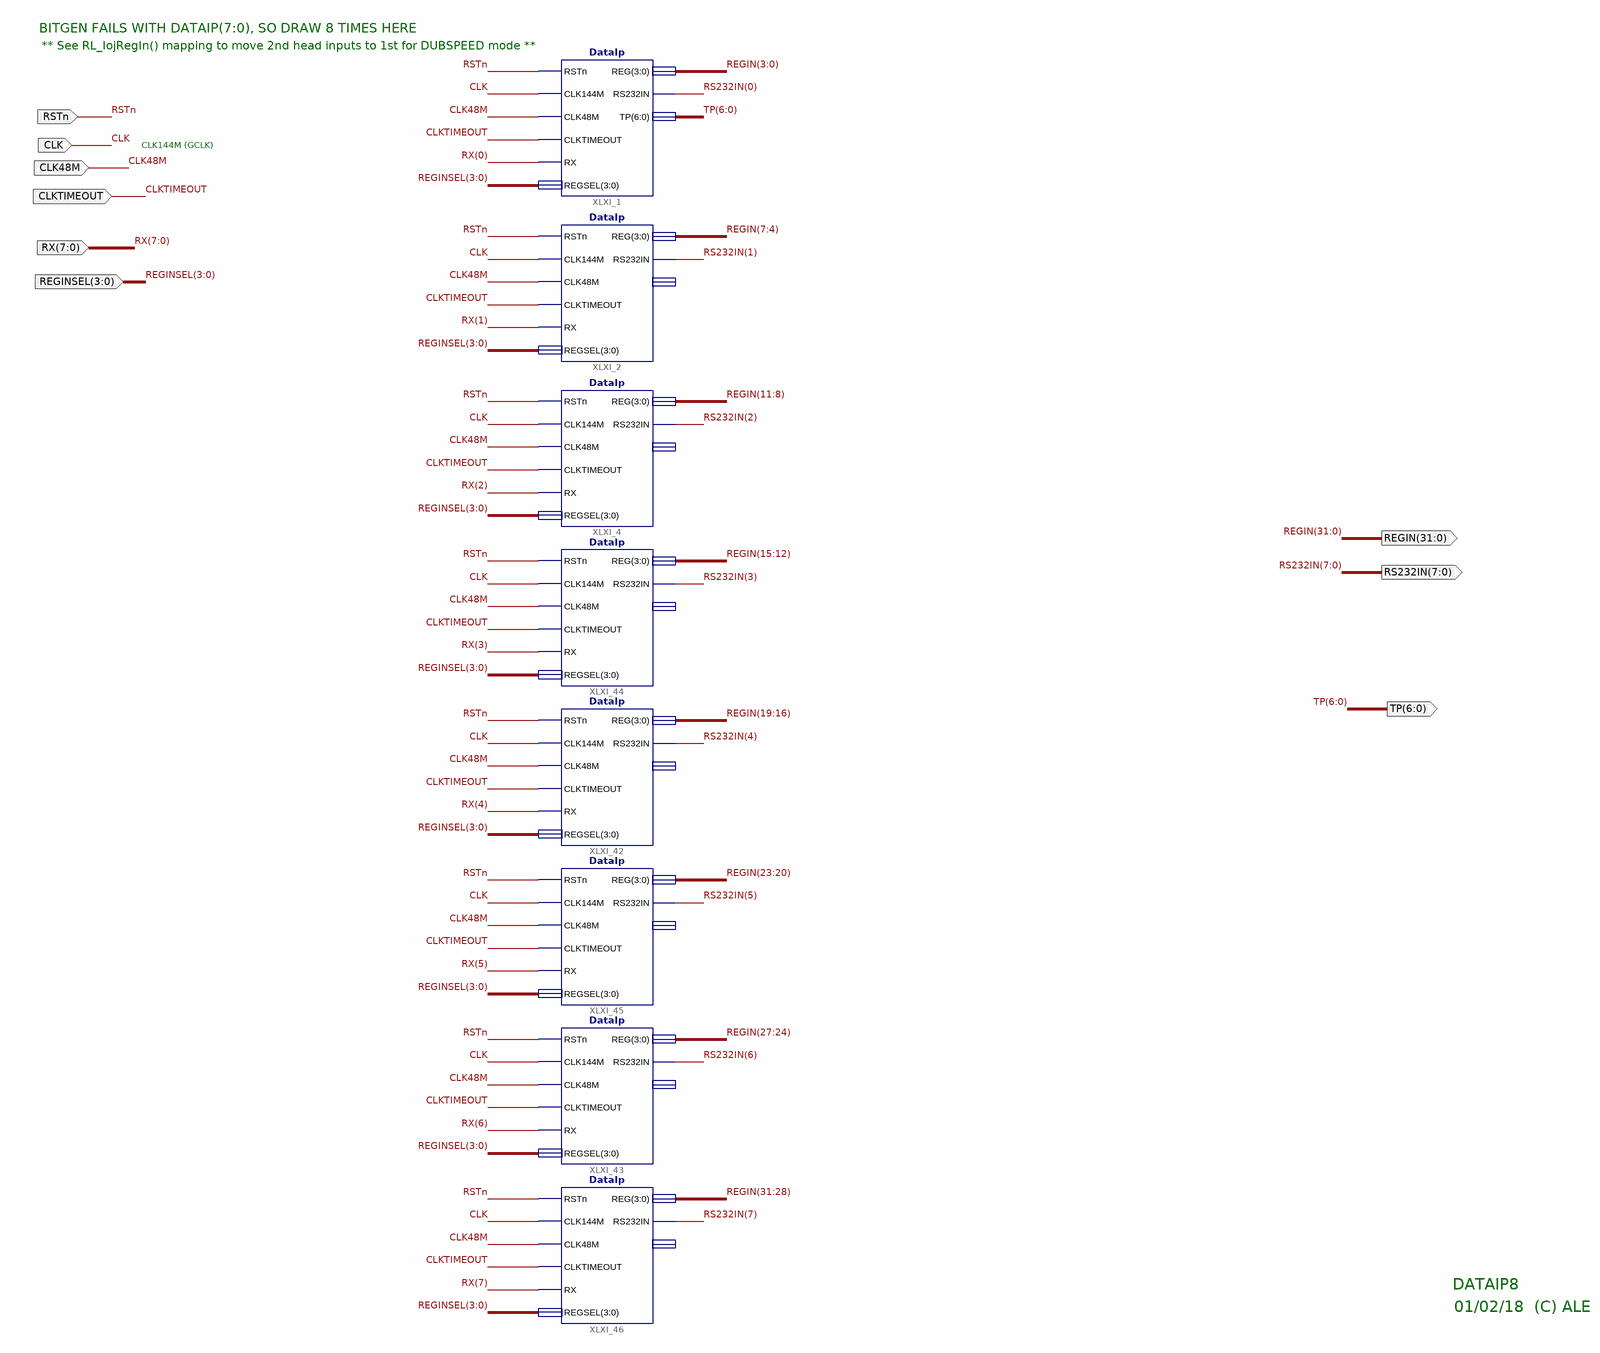
[diagram p0: schematic sheet 1]
// Xilinx ISE schematic DataIp8.sch (spartan6) as structural Verilog: 8 symbols, 9 ports
module DataIp8 (
  input  CLK,
  input  [3:0] REGINSEL,
  input  [7:0] RX,
  input  CLKTIMEOUT,
  input  RSTn,
  input  CLK48M,
  output [6:0] TP,
  output [31:0] REGIN,
  output [7:0] RS232IN
);

  DataIp XLXI_1 (
    .CLK144M(CLK), .CLK48M(CLK48M), .CLKTIMEOUT(CLKTIMEOUT), .REG(REGIN[3:0]), .REGSEL(REGINSEL),
    .RS232IN(RS232IN[0]), .RSTn(RSTn), .RX(RX[0]), .TP(TP));
  DataIp XLXI_2 (
    .CLK144M(CLK), .CLK48M(CLK48M), .CLKTIMEOUT(CLKTIMEOUT), .REG(REGIN[7:4]), .REGSEL(REGINSEL),
    .RS232IN(RS232IN[1]), .RSTn(RSTn), .RX(RX[1]));  // open: TP
  DataIp XLXI_4 (
    .CLK144M(CLK), .CLK48M(CLK48M), .CLKTIMEOUT(CLKTIMEOUT), .REG(REGIN[11:8]), .REGSEL(REGINSEL),
    .RS232IN(RS232IN[2]), .RSTn(RSTn), .RX(RX[2]));  // open: TP
  DataIp XLXI_44 (
    .CLK144M(CLK), .CLK48M(CLK48M), .CLKTIMEOUT(CLKTIMEOUT), .REG(REGIN[15:12]), .REGSEL(REGINSEL),
    .RS232IN(RS232IN[3]), .RSTn(RSTn), .RX(RX[3]));  // open: TP
  DataIp XLXI_42 (
    .CLK144M(CLK), .CLK48M(CLK48M), .CLKTIMEOUT(CLKTIMEOUT), .REG(REGIN[19:16]), .REGSEL(REGINSEL),
    .RS232IN(RS232IN[4]), .RSTn(RSTn), .RX(RX[4]));  // open: TP
  DataIp XLXI_45 (
    .CLK144M(CLK), .CLK48M(CLK48M), .CLKTIMEOUT(CLKTIMEOUT), .REG(REGIN[23:20]), .REGSEL(REGINSEL),
    .RS232IN(RS232IN[5]), .RSTn(RSTn), .RX(RX[5]));  // open: TP
  DataIp XLXI_43 (
    .CLK144M(CLK), .CLK48M(CLK48M), .CLKTIMEOUT(CLKTIMEOUT), .REG(REGIN[27:24]), .REGSEL(REGINSEL),
    .RS232IN(RS232IN[6]), .RSTn(RSTn), .RX(RX[6]));  // open: TP
  DataIp XLXI_46 (
    .CLK144M(CLK), .CLK48M(CLK48M), .CLKTIMEOUT(CLKTIMEOUT), .REG(REGIN[31:28]), .REGSEL(REGINSEL),
    .RS232IN(RS232IN[7]), .RSTn(RSTn), .RX(RX[7]));  // open: TP

  // Notes on the sheet:
  //   BITGEN FAILS WITH DATAIP(7:0), SO DRAW 8 TIMES HERE
  //   ** See RL_IojRegIn() mapping to move 2nd head inputs to 1st for DUBSPEED mode **
  //   CLK144M (GCLK)
  //   DATAIP8
  //   01/02/18  (C) ALE
endmodule
